# Altium schematic sheet BV100011_ControlDI_8-15.SchDoc
size A
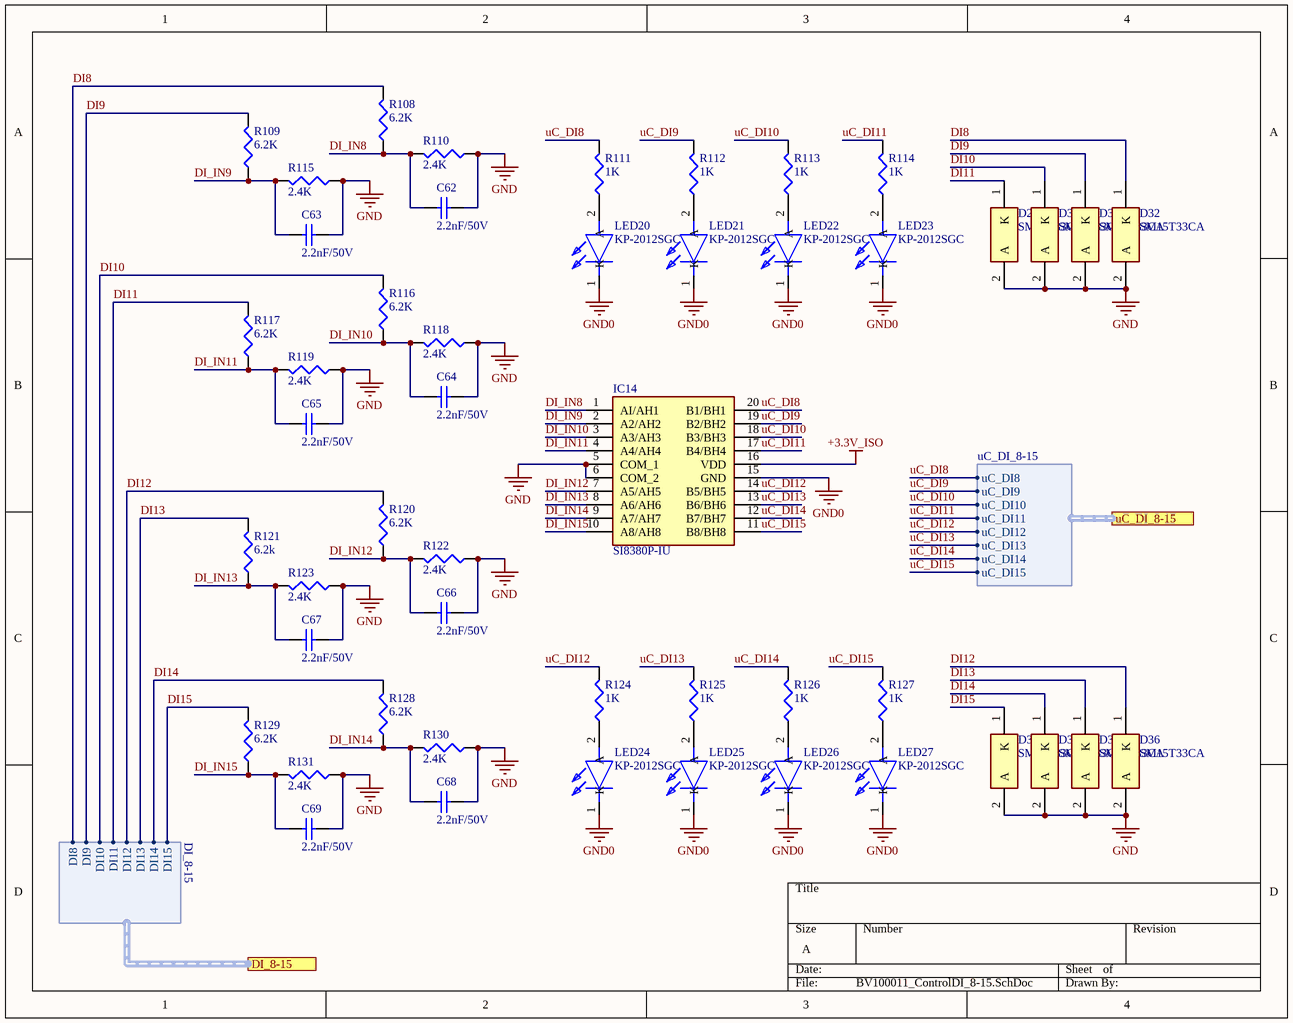
[diagram p0: BV100011_ControlDI_8-15.SchDoc]

## Parts
C62  2.2nF/50V  [C1210]
C63  2.2nF/50V  [C1210]
C64  2.2nF/50V  [C1210]
C65  2.2nF/50V  [C1210]
C66  2.2nF/50V  [C1210]
C67  2.2nF/50V  [C1210]
C68  2.2nF/50V  [C1210]
C69  2.2nF/50V  [C1210]
D29  SM15T33CA  [DIONM8059X265N]
D30  SM15T33CA  [DIONM8059X265N]
D31  SM15T33CA  [DIONM8059X265N]
D32  SM15T33CA  [DIONM8059X265N]
D33  SM15T33CA  [DIONM8059X265N]
D34  SM15T33CA  [DIONM8059X265N]
D35  SM15T33CA  [DIONM8059X265N]
D36  SM15T33CA  [DIONM8059X265N]
IC14  SI8380P-IU  [SOP64P600X175-20N]
LED20  KP-2012SGC  [LEDC2012X110N]
LED21  KP-2012SGC  [LEDC2012X110N]
LED22  KP-2012SGC  [LEDC2012X110N]
LED23  KP-2012SGC  [LEDC2012X110N]
LED24  KP-2012SGC  [LEDC2012X110N]
LED25  KP-2012SGC  [LEDC2012X110N]
LED26  KP-2012SGC  [LEDC2012X110N]
LED27  KP-2012SGC  [LEDC2012X110N]
R108  6.2K  [12Z-2010]
R109  6.2K  [12Z-2010]
R110  2.4K  [12Z-2010]
R111  1K  [0402]
R112  1K  [0402]
R113  1K  [0402]
R114  1K  [0402]
R115  2.4K  [12Z-2010]
R116  6.2K  [12Z-2010]
R117  6.2K  [12Z-2010]
R118  2.4K  [12Z-2010]
R119  2.4K  [12Z-2010]
R120  6.2K  [12Z-2010]
R121  6.2k  [12Z-2010]
R122  2.4K  [12Z-2010]
R123  2.4K  [12Z-2010]
R124  1K  [0402]
R125  1K  [0402]
R126  1K  [0402]
R127  1K  [0402]
R128  6.2K  [12Z-2010]
R129  6.2K  [12Z-2010]
R130  2.4K  [12Z-2010]
R131  2.4K  [12Z-2010]

## Ports
DI_8-15 (harness DI_8-15), uC_DI_8-15 (harness uC_DI_8-15)

## Harnesses
DI_8-15: DI8, DI9, DI10, DI11, DI12, DI13, DI14, DI15
uC_DI_8-15: uC_DI8, uC_DI9, uC_DI10, uC_DI11, uC_DI12, uC_DI13, uC_DI14, uC_DI15

## Nets
+3.3V_ISO: IC14.16(VDD)
GND: C62.2 C63.2 C64.2 C65.2 C66.2 C67.2 C68.2 C69.2 D29.2(A) D30.2(A) D31.2(A) D32.2(A) D33.2(A) D34.2(A) D35.2(A) D36.2(A) IC14.5(COM_1) IC14.6(COM_2) R110.1 R115.1 R118.1 R119.1 R122.1 R123.1 R130.1 R131.1
GND0: IC14.15(GND) LED20.1(K) LED21.1(K) LED22.1(K) LED23.1(K) LED24.1(K) LED25.1(K) LED26.1(K) LED27.1(K)
DI8: D32.1(K) R108.2 ; port DI_8-15.DI8
DI9: D31.1(K) R109.2 ; port DI_8-15.DI9
DI10: D30.1(K) R116.2 ; port DI_8-15.DI10
DI11: D29.1(K) R117.2 ; port DI_8-15.DI11
DI12: D36.1(K) R120.2 ; port DI_8-15.DI12
DI13: D35.1(K) R121.2 ; port DI_8-15.DI13
DI14: D34.1(K) R128.2 ; port DI_8-15.DI14
DI15: D33.1(K) R129.2 ; port DI_8-15.DI15
DI_IN8: C62.1 IC14.1(AI/AH1) R108.1 R110.2
DI_IN9: C63.1 IC14.2(A2/AH2) R109.1 R115.2
DI_IN10: C64.1 IC14.3(A3/AH3) R116.1 R118.2
DI_IN11: C65.1 IC14.4(A4/AH4) R117.1 R119.2
DI_IN12: C66.1 IC14.7(A5/AH5) R120.1 R122.2
DI_IN13: C67.1 IC14.8(A6/AH6) R121.1 R123.2
DI_IN14: C68.1 IC14.9(A7/AH7) R128.1 R130.2
DI_IN15: C69.1 IC14.10(A8/AH8) R129.1 R131.2
uC_DI8: IC14.20(B1/BH1) R111.2 ; port uC_DI_8-15.uC_DI8
uC_DI9: IC14.19(B2/BH2) R112.2 ; port uC_DI_8-15.uC_DI9
uC_DI10: IC14.18(B3/BH3) R113.2 ; port uC_DI_8-15.uC_DI10
uC_DI11: IC14.17(B4/BH4) R114.2 ; port uC_DI_8-15.uC_DI11
uC_DI12: IC14.14(B5/BH5) R124.2 ; port uC_DI_8-15.uC_DI12
uC_DI13: IC14.13(B6/BH6) R125.2 ; port uC_DI_8-15.uC_DI13
uC_DI14: IC14.12(B7/BH7) R126.2 ; port uC_DI_8-15.uC_DI14
uC_DI15: IC14.11(B8/BH8) R127.2 ; port uC_DI_8-15.uC_DI15
NetLED20_2: LED20.2(A) R111.1
NetLED21_2: LED21.2(A) R112.1
NetLED22_2: LED22.2(A) R113.1
NetLED23_2: LED23.2(A) R114.1
NetLED24_2: LED24.2(A) R124.1
NetLED25_2: LED25.2(A) R125.1
NetLED26_2: LED26.2(A) R126.1
NetLED27_2: LED27.2(A) R127.1

## Library data of the parts
C62-C69 = Cap Semi: Capacitor (Semiconductor SIM Model); Published: 8-Jun-2000; LatestRevisionDate: 29-May-2009; LatestRevisionNote: IPC-7351 Footprint Added.; PackageReference: C1206; Publisher: Altium Limited; PackageDescription: Chip Capacitor; Value: 2.2nF/50V
D29-D36 = SM15T33CA: Diode; Manufacturer_Name: STMicroelectronics; Allied_Number: 70390412; Datasheet Link: http://www.st.com/web/en/resource/technical/document/datasheet/CD00000724.pdf; Height: 2.65mm; Manufacturer_Part_Number: SM15T33CA; Mouser Part Number: 511-SM15T33CA; Mouser Price/Stock: https://www.mouser.com/Search/Refine.aspx?Keyword=511-SM15T33CA; RS Part Number: 9196428; RS Price/Stock: https://uk.rs-online.com/web/p/products/9196428; Allied Price/Stock: http://www.alliedelec.com/stmicroelectronics-sm15t33ca/70390412/
IC14 = SI8380P-IU: Integrated Circuit; Manufacturer_Name: Silicon Labs; Datasheet Link: https://componentsearchengine.com/Datasheets/1/SI8380P-IU.pdf; Height: 1.75mm; Mouser Part Number: 634-SI8380P-IU; Mouser Price/Stock: https://www.mouser.com/Search/Refine.aspx?Keyword=634-SI8380P-IU; Manufacturer_Part_Number: SI8380P-IU
LED20-LED27 = KP-2012SGC: LED; Manufacturer_Name: Kingbright; Datasheet Link: http://my.rs-online.com/webdocs/032f/0900766b8032fa8b.pdf; Height: 1.1mm; Manufacturer_Part_Number: KP-2012SGC; Mouser Part Number: N/A; Mouser Price/Stock: https://www.mouser.com/Search/Refine.aspx?Keyword=N%2FA; RS Part Number: 4663807; RS Price/Stock: https://uk.rs-online.com/web/p/products/4663807
R108-R131 = Res3: Resistor; Published: 8-Jun-2000; LatestRevisionDate: 29-May-2009; LatestRevisionNote: IPC-7351 Footprint Added.; PackageReference: J1-0603; Publisher: Altium Limited; PackageDescription: Chip Resistor
  R108 R109 R116 R117 R120 R128 R129: Value: 6.2K
  R110 R115 R118 R119 R122 R123 R130 R131: Value: 2.4K
  R111-R114 R124-R127: Value: 1K
  R121: Value: 6.2k